# EAGLE schematic Power_board_teensy V2.0 (EAGLE 7.6.0)
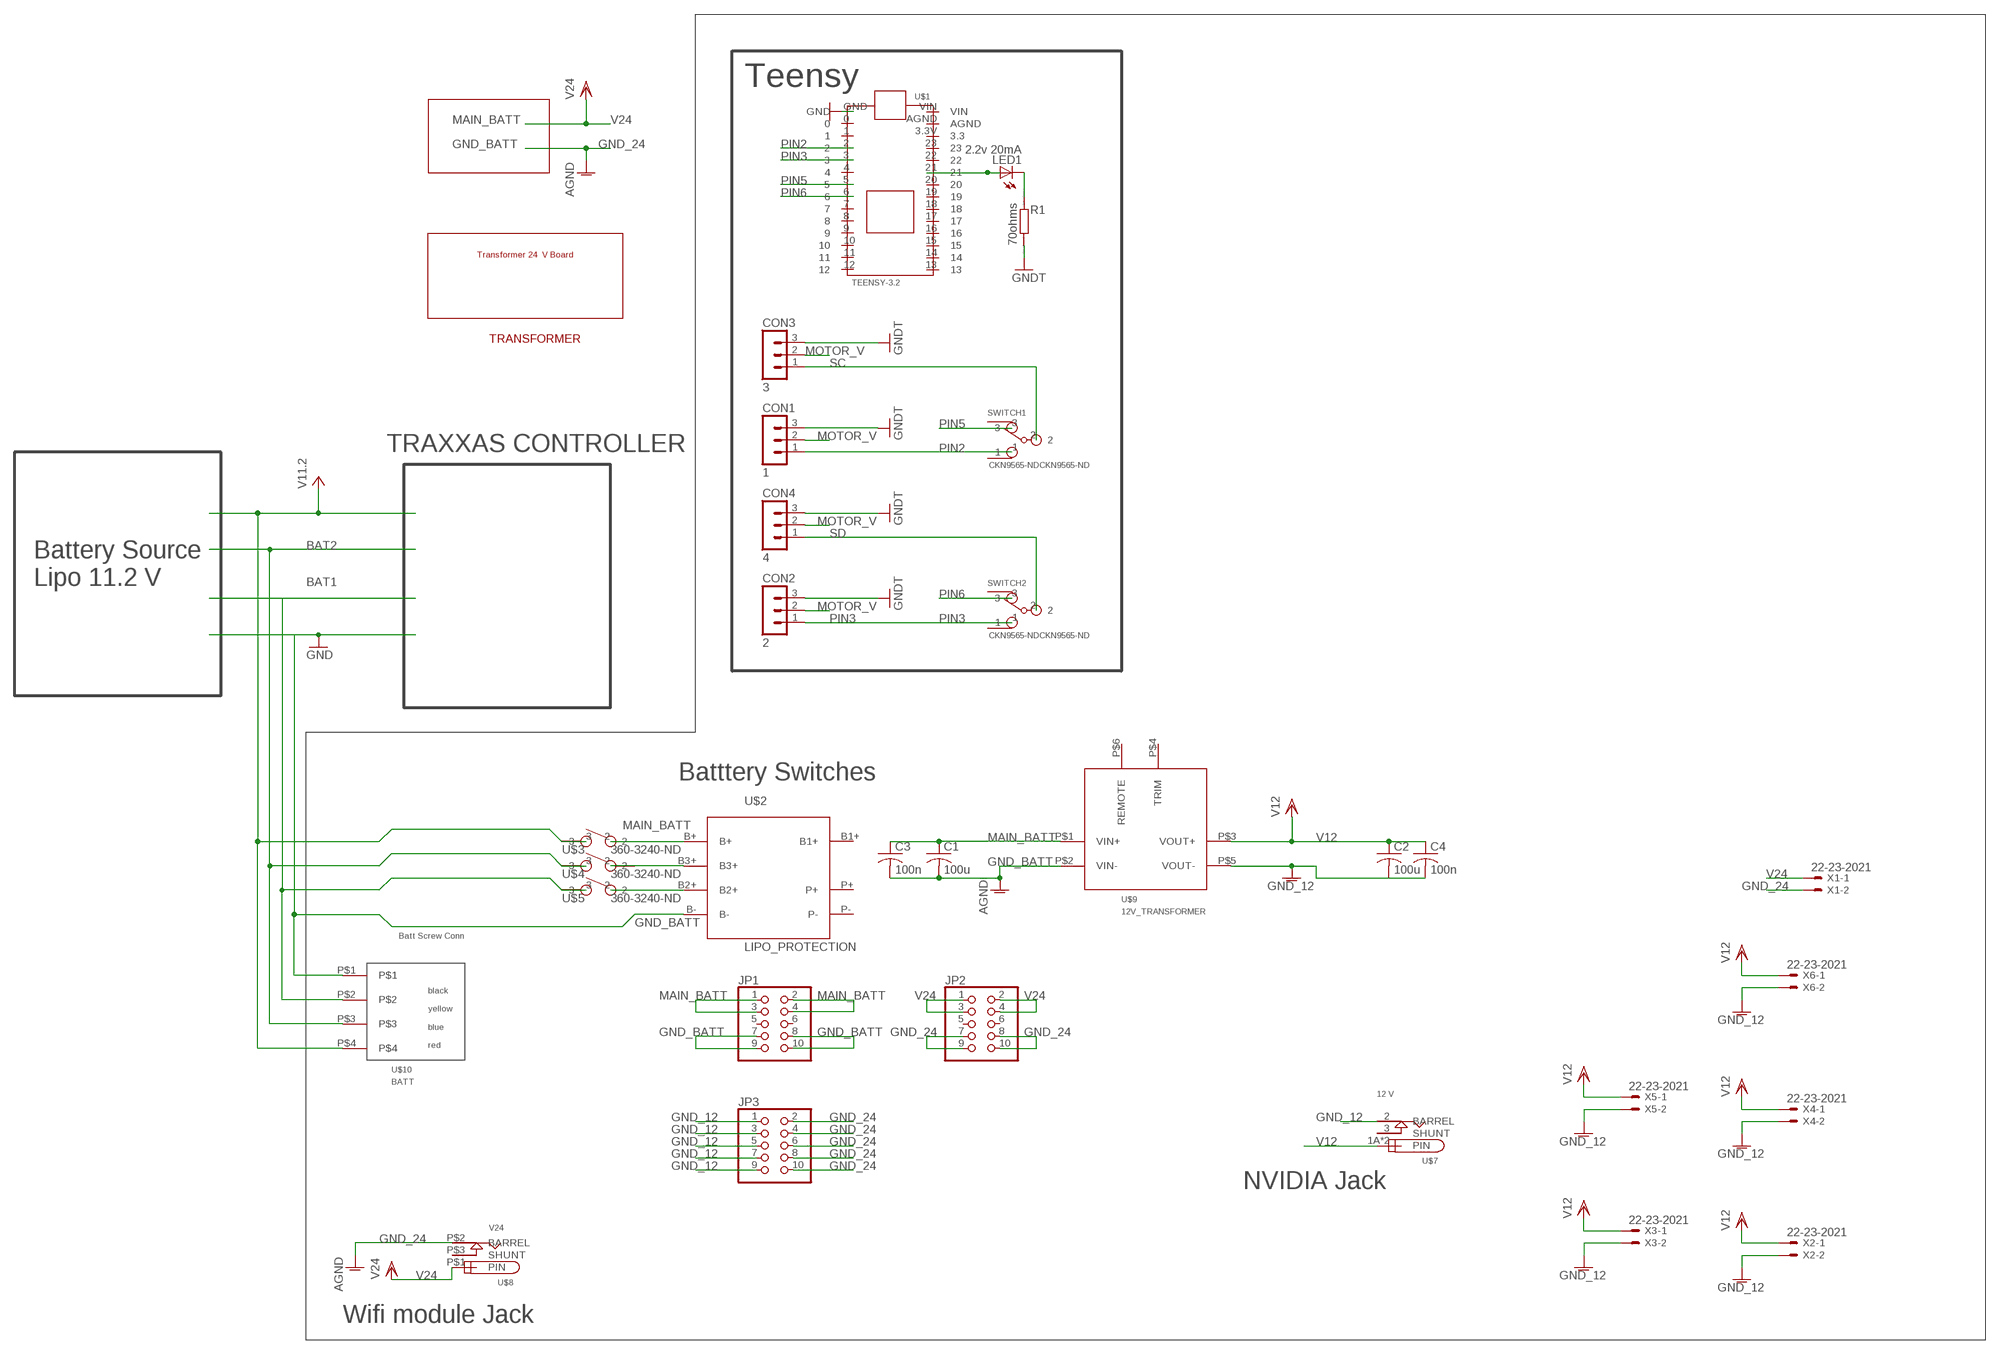
[diagram p0: schematic, sheet 1]

## Parts
C1  100u  C-US050-035X075  [C050-035X075]
C2  100u  C-US050-035X075  [C050-035X075]
C3  100n  C-US050-035X075  [C050-035X075]
C4  100n  C-US050-035X075  [C050-035X075]
CON1  1  MA03-1  [MA03-1]
CON2  2  MA03-1  [MA03-1]
CON3  3  MA03-1  [MA03-1]
CON4  4  MA03-1  [MA03-1]
JP1  PINHD-2X5  [2X05]
JP2  PINHD-2X5  [2X05]
JP3  PINHD-2X5  [2X05]
LED1  2.2v 20mA  LED5MM  [LED5MM]
R1  70ohms  R0207/10  [0207/10]
SWITCH1  CKN9565-NDCKN9565-ND  [CKN9565-ND]
SWITCH2  CKN9565-NDCKN9565-ND  [CKN9565-ND]
U$1  TEENSY-3.2  TEENSY-3.2TEENSY-3.2  [TEENSY-3.2]
U$2  LIPO_PROTECTION  [LIPO_PROTECTION]
U$3  360-3240-ND  [360-3240-ND]
U$4  360-3240-ND  [360-3240-ND]
U$5  360-3240-ND  [360-3240-ND]
U$6  TRANSFORMER_24  [24V_TRANSFORMER]
U$7  12 V  CP-054-ND  [CP-054-ND]
U$8  V24  PJ-031DH  [PJ-036AH]
U$9  12V_TRANSFORMER  [12V_TRANSFORMER]
U$10  BATT  BATTERY_CONNECTOR  [BATTERY_CONNECTOR]
X1  22-23-2021  [22-23-2021]
X2  22-23-2021  [22-23-2021]
X3  22-23-2021  [22-23-2021]
X4  22-23-2021  [22-23-2021]
X5  22-23-2021  [22-23-2021]
X6  22-23-2021  [22-23-2021]

## Nets
BAT1: U$5.3 U$10.P$2
BAT2: U$4.3 U$10.P$3
GND_12: C2.2 C4.2 JP3.1 JP3.3 JP3.5 JP3.7 JP3.9 U$7.2(BARREL) U$9.P$5(VOUT-) X2.2 X3.2 X4.2 X5.2 X6.2
GND_24: JP2.7 JP2.8 JP2.9 JP2.10 JP3.2 JP3.4 JP3.6 JP3.8 JP3.10 U$8.P$2(BARREL) X1.2 ; supply symbol labelled AGND
GND_BATT: C1.2 C3.2 JP1.7 JP1.8 JP1.9 JP1.10 U$2.B- U$9.P$2(VIN-) U$10.P$1 ; supply symbol labelled GND, AGND
GNDT: CON1.3 CON2.3 CON3.3 CON4.3 R1.2 U$1.GND
MAIN_BATT: C1.1 C3.1 JP1.1 JP1.2 JP1.3 JP1.4 U$2.B+ U$3.2 U$9.P$1(VIN+)
MOTOR_V: CON1.2 CON2.2 CON3.2 CON4.2
N$2: LED1.A U$1.21
N$4: U$2.B3+ U$4.2
N$6: U$2.B2+ U$5.2
N$8: LED1.K(C) R1.1
PIN2: CON1.1 SWITCH1.1 U$1.2
PIN3: CON2.1 SWITCH2.1 U$1.3
PIN5: SWITCH1.3 U$1.5
PIN6: SWITCH2.3 U$1.6
SC: CON3.1 SWITCH1.2
SD: CON4.1 SWITCH2.2
V11.2: U$3.3 U$10.P$4
V12: C2.1 C4.1 U$7.1A(PIN) U$7.1B(PIN) U$9.P$3(VOUT+) X2.1 X3.1 X4.1 X5.1 X6.1
V24: JP2.1 JP2.2 JP2.3 JP2.4 U$8.P$1(PIN) X1.1
Unconnected: JP1.5 JP1.6 JP2.5 JP2.6 U$1.0 U$1.1 U$1.3.3V(3.3) U$1.4 U$1.7 U$1.8 U$1.9 U$1.10 U$1.11 U$1.12 U$1.13 U$1.14 U$1.15 U$1.16 U$1.17 U$1.18 U$1.19 U$1.20 U$1.22 U$1.23 U$1.AGND U$1.VIN U$2.B1+ U$2.P+ U$2.P- U$7.3(SHUNT) U$8.P$3(SHUNT) U$9.P$4(TRIM) U$9.P$6(REMOTE)

## Notes on the sheet
- Teensy
- TRANSFORMER
- TRAXXAS CONTROLLER
- Battery Source 
  Lipo 11.2 V
- Batttery Switches
- Batt Screw Conn
- NVIDIA Jack
- Wifi module Jack

## Library data of the parts
C1-C4 = resistor:C-US: CAPACITOR, American symbol
CON1-CON4 = con-lstb:MA03-1: PIN HEADER; OC_FARNELL: unknown; OC_NEWARK: unknown
JP1-JP3 = pinhead:PINHD-2X5: PIN HEADER
LED1 = led:LED: LED OSRAM: - CHIPLED LG R971, LG N971, LY N971, LG Q971, LY Q971, LO R971, LY R971 LH N974, LH R974 LS Q976, LO Q976, LY Q976 LO Q996 - Hyper CHIPLED LW Q18S LB Q993, LB Q99A, LB R99A - SideLED LS A670, LO A670, LY A670, LG A670, LP A670 LB A673, LV A673, LT A673, LW A673 LH A674 LY A675 LS A676, LA A676, LO A676, LY A676, LW A676 LS A679, LY A679, LG A679 - Hyper Micro SIDELED® LS Y876, LA Y876, LO Y876, LY Y876 LT Y87S - SmartLED LW L88C, LW L88S LB L89C, LB L89S, LG L890 LS L89K, LO L89K, LY L89K LS L896, LA L896, LO L896, LY L896 - TOPLED LS T670, LO T670, LY T670, LG T670, LP T670 LSG T670, LSP T670, LSY T670, LOP T670, LYG T670 LG T671, LOG T671, LSG T671 LB T673, LV T673, LT T673, LW T673 LH T674 LS T676, LA T676, LO T676, LY T676, LB T676, LH T676, LSB T676, LW T676 LB T67C, LV T67C, LT T67C, LS T67K, LO T67K, LY T67K, LW E67C LS E67B, LA E67B, LO E67B, LY E67B, LB E67C, LV E67C, LT E67C LW T67C LS T679, LY T679, LG T679 LS T770, LO T770, LY T770, LG T770, LP T770 LB T773, LV T773, LT T773, LW T773 LH T774 LS E675, LA E675, LY E675, LS T675 LS T776, LA T776, LO T776, LY T776, LB T776 LHGB T686 LT T68C, LB T68C - Hyper Mini TOPLED® LB M676 - Mini TOPLED Santana® LG M470 LS M47K, LO M47K, LY M47K Source: http://www.osram.convergy.de LUXEON: - LUMILED® LXK2-PW12-R00, LXK2-PW12-S00, LXK2-PW14-U00, LXK2-PW14-V00 LXK2-PM12-R00, LXK2-PM12-S00, LXK2-PM14-U00 LXK2-PE12-Q00, LXK2-PE12-R00, LXK2-PE12-S00, LXK2-PE14-T00, LXK2-PE14-U00 LXK2-PB12-K00, LXK2-PB12-L00, LXK2-PB12-M00, LXK2-PB14-N00, LXK2-PB14-P00, LXK2-PB14-Q00 LXK2-PR12-L00, LXK2-PR12-M00, LXK2-PR14-Q00, LXK2-PR14-R00 LXK2-PD12-Q00, LXK2-PD12-R00, LXK2-PD12-S00 LXK2-PH12-R00, LXK2-PH12-S00 LXK2-PL12-P00, LXK2-PL12-Q00, LXK2-PL12-R00 Source: www.luxeon.com KINGBRIGHT: KA-3528ASYC Source: www.kingbright.com
R1 = eagle-ltspice:R: RESISTOR, European symbol; SPICEMODEL: NONE; SPICEPREFIX: R
SWITCH1 SWITCH2 = CS_LIB:CKN9565-ND
U$1 = CS_LIB:TEENSY-3.2: 0.1" pin spacing
U$2 = CS_LIB:LIPO_PROTECTION
U$3-U$5 = CS_LIB:360-3240-ND: SPST two lead switch Pin 2 is common Swtich Closed on Down Position DigiKey: http://www.digikey.com/product-detail/en/nkk-switches/M2011S2A1W01/360-3240-ND/1049342 Data Sheet: http://2t70un3m1d9z1kztamkdrd38.wpengine.netdna-cdn.com/wp-content/uploads/2016/02/MtogglesBushing.pdf
U$6 = CS_LIB:TRANSFORMER_24
U$7 = CS_LIB:CP-054-ND: DigiKey: http://www.digikey.com/product-detail/en/cui-inc/PJ-054/CP-054-ND/1644595 Data Sheet: http://www.cui.com/product/resource/pj-054.pdf
U$8 = CS_LIB:PJ-031DH: Barrel Jack Connector 5mm long, 2.7mm wide, spacing DigiKey: http://www.digikey.com/product-detail/en/cui-inc/PJ-031DH/CP-031DH-ND/1644524 Data Sheet: http://www.cui.com/catalog/resource/connector-mating-guide.pdf
U$9 = CS_LIB:12V_TRANSFORMER: CUI Inc │ SERIES: PDQ30-D │ DESCRIPTION: DC-DC CONVERTER http://www.mouser.com/pdfdocs/pdq30-d.pdf
U$10 = CS_LIB:BATTERY_CONNECTOR
X1-X6 = con-molex:22-23-2021: .100" (2.54mm) Center Header - 2 Pin; MF: MOLEX; MPN: 22-23-2021; OC_FARNELL: 1462926; OC_NEWARK: 25C3832